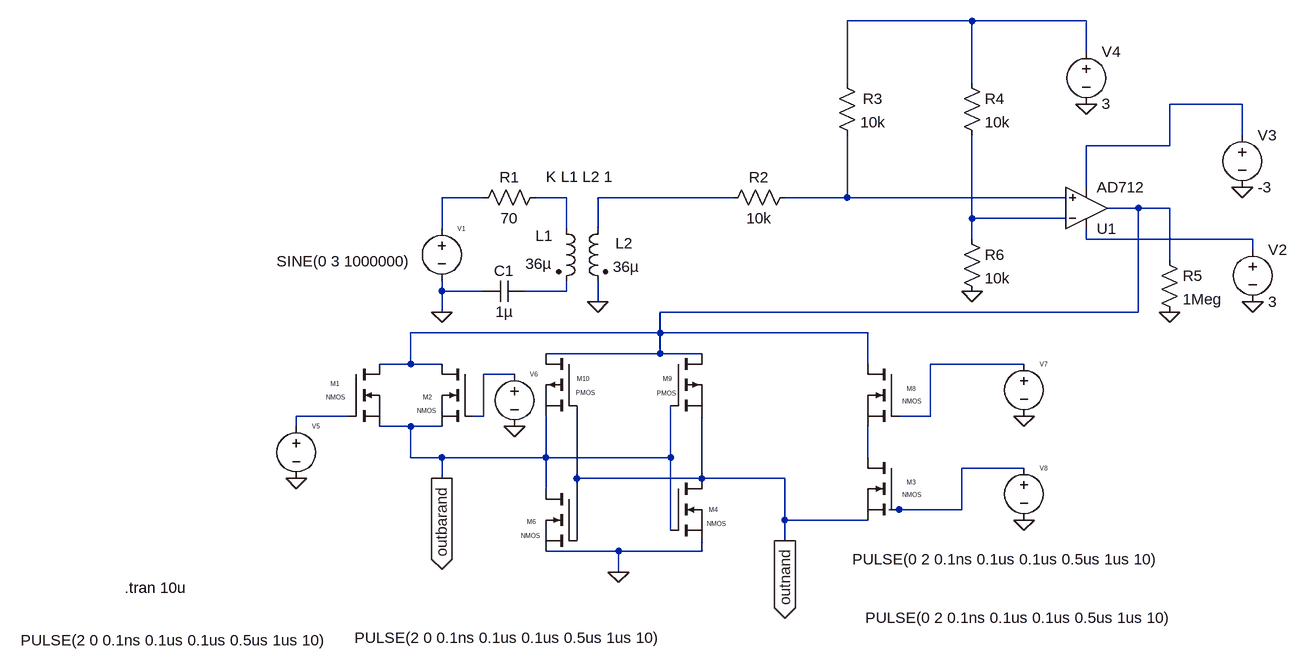
[diagram p0: schematic PFAL_wireless_sin.asc]
PFAL_wireless_sin.asc, the LTspice schematic file:
Version 4
SHEET 1 1252 1000
WIRE 672 -432 480 -432
WIRE 848 -432 672 -432
WIRE 848 -384 848 -432
WIRE 480 -336 480 -432
WIRE 672 -336 672 -432
WIRE 1088 -304 976 -304
WIRE 1088 -256 1088 -304
WIRE 976 -240 976 -304
WIRE 976 -240 848 -240
WIRE 848 -176 848 -240
WIRE -80 -160 -144 -160
WIRE 48 -160 0 -160
WIRE 304 -160 96 -160
WIRE 480 -160 480 -256
WIRE 480 -160 384 -160
WIRE 816 -160 480 -160
WIRE 928 -144 880 -144
WIRE 976 -144 928 -144
WIRE 672 -128 672 -256
WIRE 816 -128 672 -128
WIRE -144 -112 -144 -160
WIRE 48 -112 48 -160
WIRE 96 -112 96 -160
WIRE 672 -96 672 -128
WIRE 848 -96 848 -112
WIRE 1104 -96 848 -96
WIRE 1104 -80 1104 -96
WIRE 976 -64 976 -144
WIRE -144 -16 -144 -32
WIRE -80 -16 -144 -16
WIRE 48 -16 48 -32
WIRE 48 -16 -16 -16
WIRE 96 0 96 -32
WIRE -144 16 -144 -16
WIRE 928 16 928 -144
WIRE 928 16 192 16
WIRE 192 48 192 16
WIRE 192 48 -192 48
WIRE 512 48 192 48
WIRE 192 80 192 48
WIRE 192 80 16 80
WIRE 256 80 192 80
WIRE -192 96 -192 48
WIRE -192 96 -240 96
WIRE -144 96 -192 96
WIRE 512 96 512 48
WIRE 752 96 608 96
WIRE -32 112 -80 112
WIRE -288 176 -368 176
WIRE -80 176 -80 112
WIRE -80 176 -96 176
WIRE 608 176 608 96
WIRE 608 176 560 176
WIRE -368 192 -368 176
WIRE -192 192 -240 192
WIRE -144 192 -192 192
WIRE -192 240 -192 192
WIRE -144 240 -192 240
WIRE 16 240 16 176
WIRE 16 240 -144 240
WIRE 208 240 208 160
WIRE 208 240 16 240
WIRE 512 240 512 192
WIRE 752 256 656 256
WIRE -144 272 -144 240
WIRE 64 272 64 160
WIRE 256 272 256 176
WIRE 256 272 64 272
WIRE 384 272 256 272
WIRE 16 288 16 240
WIRE 560 320 544 320
WIRE 656 320 656 256
WIRE 656 320 560 320
WIRE 384 336 384 272
WIRE 512 336 384 336
WIRE 208 352 208 240
WIRE 64 368 64 272
WIRE 384 368 384 336
WIRE 128 384 16 384
WIRE 256 384 256 368
WIRE 256 384 128 384
WIRE 128 416 128 384
FLAG 128 416 0
FLAG 96 0 0
FLAG -144 16 0
FLAG 672 -16 0
FLAG 976 16 0
FLAG 848 -304 0
FLAG 1088 -176 0
FLAG 1104 0 0
FLAG -368 272 0
FLAG -32 192 0
FLAG 752 336 0
FLAG 752 176 0
FLAG -144 272 outbarand
IOPIN -144 272 Out
FLAG 384 368 outnand
IOPIN 384 368 Out
SYMBOL nmos -288 96 R0
WINDOW 0 -27 30 Left 0
WINDOW 3 -34 51 Left 0
SYMATTR InstName M1
SYMBOL nmos 208 272 R0
WINDOW 0 59 48 Left 0
WINDOW 3 56 70 Left 0
SYMATTR InstName M4
SYMBOL nmos 64 288 M0
WINDOW 0 63 51 Left 0
WINDOW 3 56 72 Left 0
SYMATTR InstName M6
SYMBOL nmos 560 96 M0
WINDOW 0 -26 38 Left 0
WINDOW 3 -35 57 Left 0
SYMATTR InstName M8
SYMBOL pmos 208 80 R0
WINDOW 0 -12 39 Left 0
WINDOW 3 -21 61 Left 0
SYMATTR InstName M9
SYMBOL pmos 64 80 M0
WINDOW 0 -20 39 Left 0
WINDOW 3 -28 60 Left 0
SYMATTR InstName M10
SYMBOL voltage -144 -128 R0
WINDOW 0 24 16 Left 0
WINDOW 3 -254 66 Left 2
WINDOW 123 0 0 Left 0
WINDOW 39 0 0 Left 0
SYMATTR InstName V1
SYMATTR Value SINE(0 3 1000000)
SYMBOL res 16 -176 R90
WINDOW 0 0 56 VBottom 2
WINDOW 3 32 56 VTop 2
SYMATTR InstName R1
SYMATTR Value 70
SYMBOL ind2 32 -128 R0
WINDOW 0 -32 27 Left 2
WINDOW 3 -47 70 Left 2
SYMATTR InstName L1
SYMATTR Value 36µ
SYMBOL ind2 112 -128 M0
WINDOW 0 -38 38 Left 2
WINDOW 3 -48 74 Left 2
SYMATTR InstName L2
SYMATTR Value 36µ
SYMBOL cap -16 -32 R90
WINDOW 0 0 32 VBottom 2
WINDOW 3 32 32 VTop 2
SYMATTR InstName C1
SYMATTR Value 1µ
SYMBOL res 400 -176 R90
WINDOW 0 0 56 VBottom 2
WINDOW 3 32 56 VTop 2
SYMATTR InstName R2
SYMATTR Value 10k
SYMBOL res 464 -352 R0
WINDOW 0 40 40 Left 2
SYMATTR InstName R3
SYMATTR Value 10k
SYMBOL res 656 -352 R0
SYMATTR InstName R4
SYMATTR Value 10k
SYMBOL res 960 -80 R0
SYMATTR InstName R5
SYMATTR Value 1Meg
SYMATTR SpiceLine tol=1 pwr=0.1
SYMBOL res 656 -112 R0
SYMATTR InstName R6
SYMATTR Value 10k
SYMBOL OpAmps\\AD712 848 -80 M180
SYMATTR InstName U1
SYMBOL voltage 1104 -96 R0
WINDOW 123 0 0 Left 0
WINDOW 39 0 0 Left 0
SYMATTR InstName V2
SYMATTR Value 3
SYMBOL voltage 1088 -272 R0
WINDOW 123 0 0 Left 0
WINDOW 39 0 0 Left 0
SYMATTR InstName V3
SYMATTR Value -3
SYMBOL voltage 848 -400 R0
WINDOW 123 0 0 Left 0
WINDOW 39 0 0 Left 0
SYMATTR InstName V4
SYMATTR Value 3
SYMBOL nmos -96 96 M0
WINDOW 0 63 51 Left 0
WINDOW 3 56 72 Left 0
SYMATTR InstName M2
SYMBOL nmos 560 240 M0
WINDOW 0 -26 38 Left 0
WINDOW 3 -35 57 Left 0
SYMATTR InstName M3
SYMBOL voltage -368 176 R0
WINDOW 0 24 16 Left 0
WINDOW 3 -424 345 Left 2
WINDOW 123 0 0 Left 0
WINDOW 39 0 0 Left 0
SYMATTR InstName V5
SYMATTR Value PULSE(2 0 0.1ns 0.1us 0.1us 0.5us 1us 10)
SYMBOL voltage -32 96 R0
WINDOW 0 24 16 Left 0
WINDOW 3 -246 421 Left 2
WINDOW 123 0 0 Left 0
WINDOW 39 0 0 Left 0
SYMATTR InstName V6
SYMATTR Value PULSE(2 0 0.1ns 0.1us 0.1us 0.5us 1us 10)
SYMBOL voltage 752 80 R0
WINDOW 0 24 16 Left 0
WINDOW 3 -244 406 Left 2
WINDOW 123 0 0 Left 0
WINDOW 39 0 0 Left 0
SYMATTR InstName V7
SYMATTR Value PULSE(0 2 0.1ns 0.1us 0.1us 0.5us 1us 10)
SYMBOL voltage 752 240 R0
WINDOW 0 24 16 Left 0
WINDOW 3 -264 156 Left 2
WINDOW 123 0 0 Left 0
WINDOW 39 0 0 Left 0
SYMATTR InstName V8
SYMATTR Value PULSE(0 2 0.1ns 0.1us 0.1us 0.5us 1us 10)
TEXT 16 -192 Left 2 !K L1 L2 1
TEXT -632 440 Left 2 !.tran 10u

The netlist it stands for:
* PFAL_wireless_sin.asc
M1 N007 N013 outbarand outbarand NMOS
M4 outnand outbarand 0 0 NMOS
M6 outbarand outnand 0 0 NMOS
M8 N007 N011 N014 N014 NMOS
M9 N007 outbarand outnand outnand PMOS
M10 N007 outnand outbarand outbarand PMOS
V1 N003 0 SINE(0 3 1000000)
R1 N004 N003 70
L1 N004 N010 36µ
L2 N005 0 36µ
C1 N010 0 1µ
R2 N006 N005 10k
R3 N001 N006 10k
R4 N001 N008 10k
R5 N007 0 1Meg tol=1 pwr=0.1
R6 N008 0 10k
XU1 N006 N008 N009 N002 N007 AD712  ; pins In+ In- V+ V- OUT
V2 N009 0 3
V3 N002 0 -3
V4 N001 0 3
M2 N007 N012 outbarand outbarand NMOS
M3 N014 N015 outnand outnand NMOS
V5 N013 0 PULSE(2 0 0.1ns 0.1us 0.1us 0.5us 1us 10)
V6 N012 0 PULSE(2 0 0.1ns 0.1us 0.1us 0.5us 1us 10)
V7 N011 0 PULSE(0 2 0.1ns 0.1us 0.1us 0.5us 1us 10)
V8 N015 0 PULSE(0 2 0.1ns 0.1us 0.1us 0.5us 1us 10)
.model NMOS NMOS
.model PMOS PMOS
.lib standard.mos
K L1 L2 1
.tran 10u
.backanno
.end